# Altium schematic sheet Battery Level Indicator.SchDoc
size A4; SheetNumber: 1; SheetTotal: 1
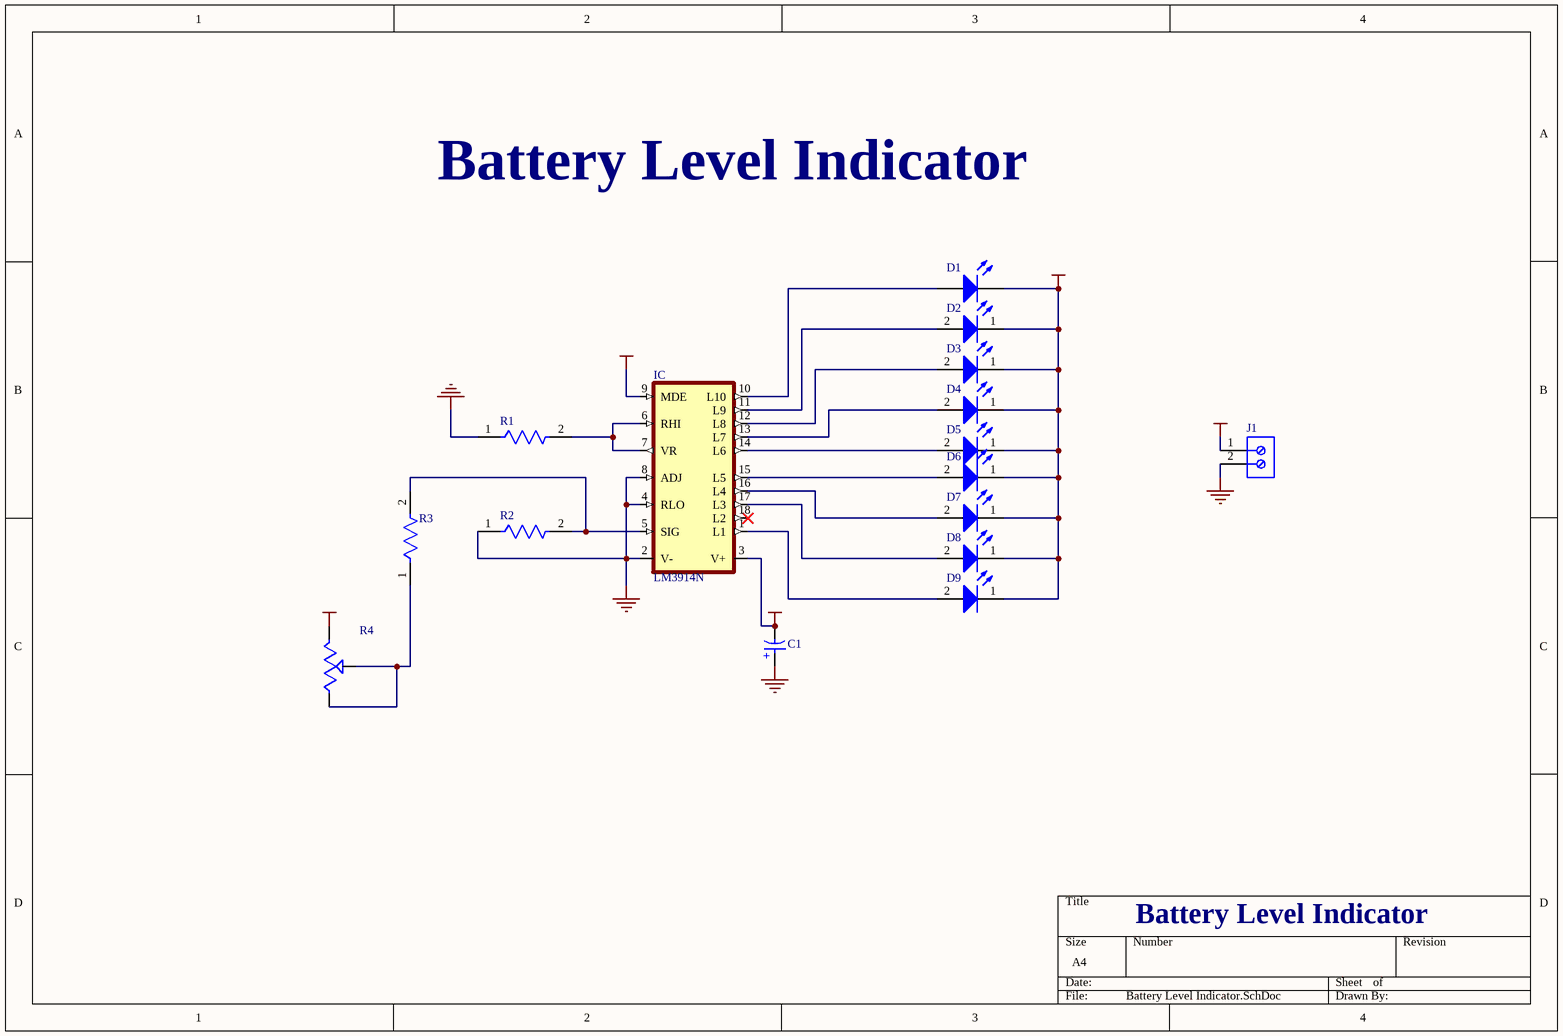
[diagram p0: Battery Level Indicator.SchDoc]

## Parts
C1  860130272001  [WCAP-ATET_D5H11]  (value not drawn)
D1  15400385A3590  [WL-TIRW_D3.9H5.3]  (value not drawn)
D2  15400385A3590  [WL-TIRW_D3.9H5.3]  (value not drawn)
D3  15400385A3590  [WL-TIRW_D3.9H5.3]  (value not drawn)
D4  15400385A3590  [WL-TIRW_D3.9H5.3]  (value not drawn)
D5  15400385A3590  [WL-TIRW_D3.9H5.3]  (value not drawn)
D6  15400385A3590  [WL-TIRW_D3.9H5.3]  (value not drawn)
D7  15400385A3590  [WL-TIRW_D3.9H5.3]  (value not drawn)
D8  15400385A3590  [WL-TIRW_D3.9H5.3]  (value not drawn)
D9  15400385A3590  [WL-TIRW_D3.9H5.3]  (value not drawn)
IC  LM3914N  [DIL18]
J1  691101710002  [691101710002]  (value not drawn)
R1  MRS25000C1000FRP00  [FP-MRS25-MFG]  (value not drawn)
R2  MRS25000C1000FRP00  [FP-MRS25-MFG]  (value not drawn)
R3  MRS25000C1000FRP00  [FP-MRS25-MFG]  (value not drawn)
R4  EVN-D8AA03B14  [TRIM_EVN-D8AA03B14]  (value not drawn)

## Nets
GND: C1.1(P) IC.2(V-) IC.4(RLO) IC.8(ADJ) J1.2 R1.1 R2.1
VCC: C1.2(N) D1.1(K) D2.1(K) D3.1(K) D4.1(K) D5.1(K) D6.1(K) D7.1(K) D8.1(K) D9.1(K) IC.3(V+) IC.9(MDE) J1.1 R4.3
NetD1_2: D1.2(A) IC.10(L10)
NetD2_2: D2.2(A) IC.11(L9)
NetD3_2: D3.2(A) IC.12(L8)
NetD4_2: D4.2(A) IC.13(L7)
NetD5_2: D5.2(A) IC.14(L6)
NetD6_2: D6.2(A) IC.15(L5)
NetD7_2: D7.2(A) IC.16(L4)
NetD8_2: D8.2(A) IC.17(L3)
NetD9_2: D9.2(A) IC.1(L1)
NetIC_5: IC.5(SIG) R2.2 R3.2
NetIC_6: IC.6(RHI) IC.7(VR) R1.2
NetR3_1: R3.1 R4.1 R4.2

Not connected (* = marked no-connect by the designer): IC 18(L2)*

## Notes on the sheet
- Battery Level Indicator
- (in symbol CMP-03913-54218058-1) +

## Library data of the parts
C1 = CMP-03913-54218058-1: 860130272001 WCAP-ATET Aluminum Electrolytic Capacitors; Capacitance: 47µF; Material: Aluminium; Voltage Rating (DC): 10V; Ripple Current: 92mA; Polarity: Polar; Leakage Current: 4.7µA; Tolerance: 20%; Pitch: 2mm; Life (Hours): 1000hours; NexarPartId: 54218058; Diameter: 5mm; Max Operating Temperature: 125°C; Length: 11mm; Lead Pitch: 2.0066mm; Voltage Rating: 10V; Height: 11mm; Height - Seated (Max): 12.4968mm; Min Operating Temperature: -40°C; Mount: Through Hole; Packaging: Tape & Box (TB); Case/Package: Radial; RoHS: Compliant
D1-D9 = CMP-03913-82270983-1: 15400385A3590 WL-TIRW THT Infrared Round Waterclear; Forward Voltage: 1.5V; Viewing Angle: 35°; Wavelength: 850nm; Max Reverse Voltage (DC): 5V; Forward Current: 1A; Packaging: Bulk; RoHS: Non-Compliant; Peak Wavelength: 850nm; NexarPartId: 82270983
IC = LM3914N: LED Lighting Drivers; MF: Texas Instruments; MP: LM3914N; Package: None; Price: None; Availability: Unavailable; Value: *; SnapEDA_Link: https://www.snapeda.com/parts/LM3914N/Texas%20Instruments/view-part/4652973/?ref=snap
J1 = CMP-1502-03256-2: NexarPartId: 8917704; Current Rating: 16A; Pitch: 5.0038mm; Stripping Length: -7mm; Plating: Steel; Voltage: 250V; Wire Gauge (Max): 26AWG; Number of Contacts: 2; Number of Levels: 1; Wire Gauge (Min): 14AWG; Number of Pins: 2; Contact Plating: Tin; Max Operating Temperature: 105°C; Contact Material: Brass; Min Operating Temperature: -40°C; Height: 16.4mm; Lead Pitch: 5mm; Length: 9mm; Termination: Screw; Current: 16A; Housing Material: Nylon; Width: 11.2mm; RoHS: Compliant; Voltage Rating: 250V; Number of Positions Per Level: 2; Mount: Through Hole; Color: Blue; Packaging: Box; REACH SVHC: Unknown; Wire/Cable Gauge: 26AWG
R1-R3 = CMP-00030-42757237-1: MRS25000C1000FRP00 Resistor, 100 Ohm, ± 1%, 600 mW, Axial Leaded, Metal Film (Thin Film), Professional; Max Power Dissipation: 600mW; Resistance: 100Ω; Voltage Rating: 350V; Temperature Coefficient: 50ppm/°C; Lead Diameter: 600µm; RoHS: Compliant; Radiation Hardening: No; Schedule B: 8533210090, 8533210090; Length: 6.5mm; Packaging: Tape & Reel (TR); Number of Terminations: 2; Mount: Through Hole; Width: 2.5mm; Tolerance: 1%; Military Standard: Not; Voltage Rating (DC): 350V; Contact Plating: Tin; Number of Pins: 2; Max Operating Temperature: 155°C; NexarPartId: 42757237; Diameter: 2.5mm; Composition: Metal Film, Thin Film; REACH SVHC: Unknown; Power Rating: 600mW; Lead Free: Lead Free; Termination: Axial; Case/Package: Axial; Min Operating Temperature: -55°C
R4 = EVN-D8AA03B14: 10 kOhms 0.1W, 1/10W PC Pins Through Hole Trimmer Potentiometer Carbon 1.0 Turn Top Adjustment; MF: Panasonic Electronic; SnapEDA_Link: https://www.snapeda.com/parts/EVN-D8AA03B14/Panasonic+Electronic+Components/view-part/?ref=snap; Package: PQFP-44 Panasonic; MP: EVN-D8AA03B14; Check_prices: https://www.snapeda.com/parts/EVN-D8AA03B14/Panasonic+Electronic+Components/view-part/?ref=eda; Purchase-URL: https://pricing.snapeda.com/search/part/EVN-D8AA03B14/?ref=eda; Price: None; Value: *; Availability: In Stock